# Altium schematic sheet Line Sensor.SchDoc
size A4
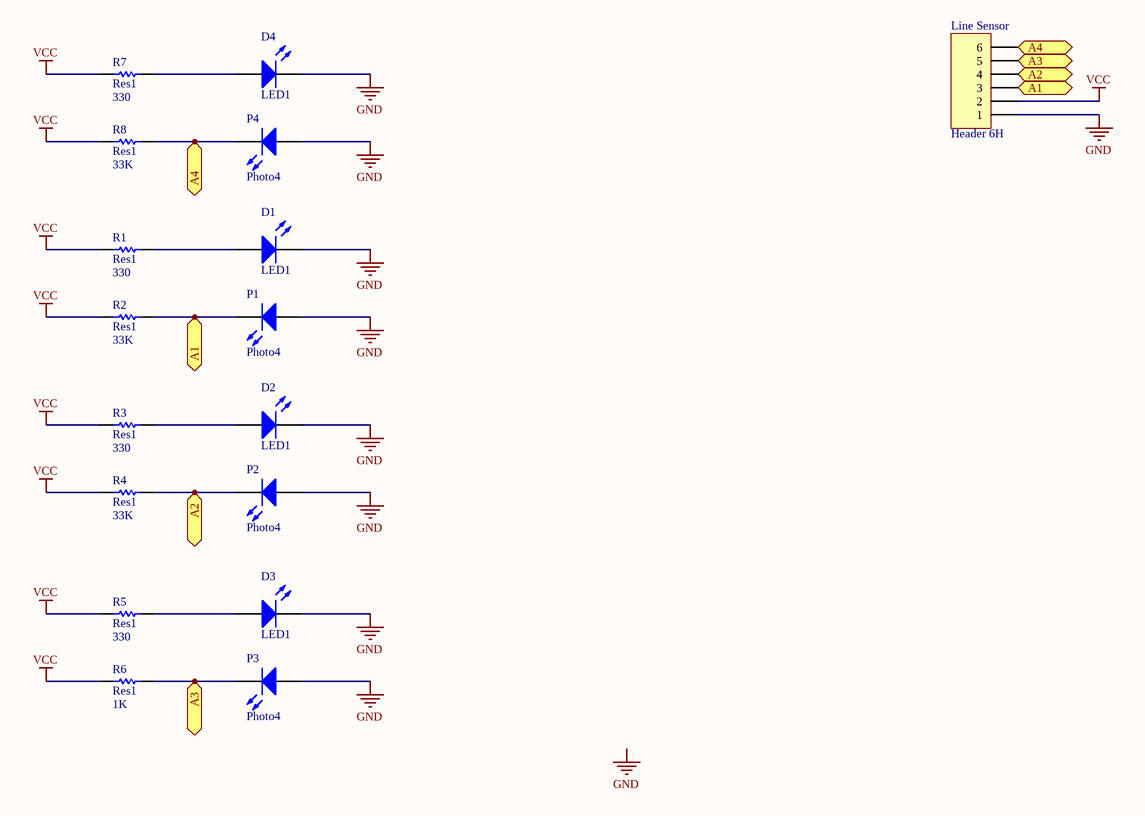
[diagram p0: Line Sensor.SchDoc]

## Parts
D1  LED1  [LED-1]
D2  LED1  [LED-1]
D3  LED1  [LED-1]
D4  LED1  [LED-1]
Line_Sensor  Header 6H  [HDR1X6H]
P1  Photo4  [LED-1]
P2  Photo4  [LED-1]
P3  Photo4  [LED-1]
P4  Photo4  [LED-1]
R1  Res1  value 330  [AXIAL-0.3]
R2  Res1  value 33K  [AXIAL-0.3]
R3  Res1  value 330  [AXIAL-0.3]
R4  Res1  value 33K  [AXIAL-0.3]
R5  Res1  value 330  [AXIAL-0.3]
R6  Res1  value 1K  [AXIAL-0.3]
R7  Res1  value 330  [AXIAL-0.3]
R8  Res1  value 33K  [AXIAL-0.3]

## Ports
A1, A2, A3, A4

## Nets
GND: D1.2(K) D2.2(K) D3.2(K) D4.2(K) Line_Sensor.1 P1.1(A) P2.1(A) P3.1(A) P4.1(A)
VCC: Line_Sensor.2 R1.1 R2.1 R3.1 R4.1 R5.1 R6.1 R7.1 R8.1
A1: Line_Sensor.3 P1.2(K) R2.2 ; port A1
A2: Line_Sensor.4 P2.2(K) R4.2 ; port A2
A3: Line_Sensor.5 P3.2(K) R6.2 ; port A3
A4: Line_Sensor.6 P4.2(K) R8.2 ; port A4
NetD1_1: D1.1(A) R1.2
NetD2_1: D2.1(A) R3.2
NetD3_1: D3.1(A) R5.2
NetD4_1: D4.1(A) R7.2

## Notes on the sheet
- Labels drawn without touching a wire or pin: GND

## Library data of the parts
D1-D4 P1-P4 = LED1: Typical RED GaAs LED; Published: 8-Jun-2000; LatestRevisionDate: 08-Jul-2005; LatestRevisionNote: Mech Layer 1 removed.; PackageReference: LED-1; Publisher: Altium Limited
Line_Sensor = Header 6H: Header, 6-Pin, Right Angle; LatestRevisionDate: 17-Jul-2002; LatestRevisionNote: Re-released for DXP Platform.; Publisher: Altium Limited
R1-R8 = Res1: Resistor; Published: 8-Jun-2000; LatestRevisionDate: 17-Jul-2002; LatestRevisionNote: Re-released for DXP Platform.; PackageReference: AXIAL-0.3; Publisher: Altium Limited